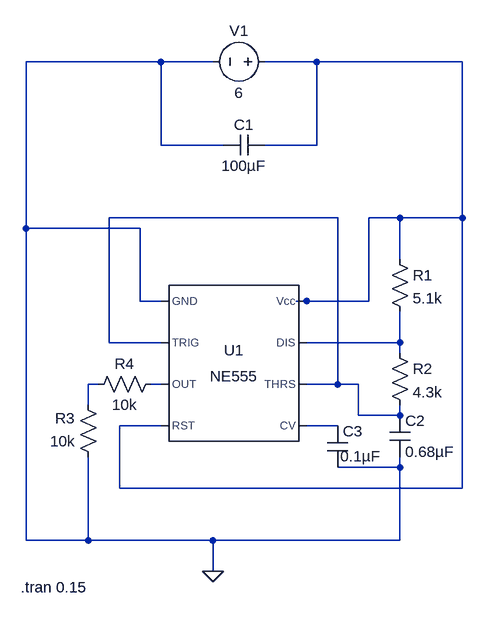
[diagram p0: schematic NE555 multivibrator.asc]
NE555 multivibrator.asc, the LTspice schematic file:
Version 4
SHEET 1 880 680
WIRE 128 -224 -80 -224
WIRE 208 -224 128 -224
WIRE 368 -224 288 -224
WIRE 592 -224 368 -224
WIRE 128 -96 128 -224
WIRE 224 -96 128 -96
WIRE 368 -96 368 -224
WIRE 368 -96 288 -96
WIRE 400 16 48 16
WIRE 496 16 448 16
WIRE 592 16 592 -224
WIRE 592 16 496 16
WIRE -80 32 -80 -224
WIRE 96 32 -80 32
WIRE 496 80 496 16
WIRE 96 144 96 32
WIRE 128 144 96 144
WIRE 352 144 336 144
WIRE 448 144 448 16
WIRE 448 144 352 144
WIRE 48 208 48 16
WIRE 128 208 48 208
WIRE 496 208 496 160
WIRE 496 208 352 208
WIRE 496 224 496 208
WIRE 32 272 16 272
WIRE 128 272 112 272
WIRE 400 272 400 16
WIRE 400 272 352 272
WIRE 432 272 400 272
WIRE 16 304 16 272
WIRE 432 320 432 272
WIRE 496 320 496 304
WIRE 496 320 432 320
WIRE 128 336 64 336
WIRE 400 336 352 336
WIRE 496 400 496 384
WIRE 496 400 400 400
WIRE 64 432 64 336
WIRE 592 432 592 16
WIRE 592 432 64 432
WIRE -80 512 -80 32
WIRE 16 512 16 384
WIRE 16 512 -80 512
WIRE 208 512 16 512
WIRE 496 512 496 400
WIRE 496 512 208 512
WIRE 208 560 208 512
FLAG 208 560 0
SYMBOL Misc\\NE555 240 240 R0
SYMATTR InstName U1
SYMBOL cap 288 -112 R90
WINDOW 0 0 32 VBottom 2
WINDOW 3 32 32 VTop 2
SYMATTR InstName C1
SYMATTR Value 100µF
SYMATTR SpiceLine V=25
SYMBOL cap 480 320 R0
SYMATTR InstName C2
SYMATTR Value 0.68µF
SYMATTR SpiceLine V=25
SYMBOL res 32 400 R180
WINDOW 0 36 76 Left 2
WINDOW 3 36 40 Left 2
SYMATTR InstName R3
SYMATTR Value 10k
SYMBOL res 480 208 R0
SYMATTR InstName R2
SYMATTR Value 4.3k
SYMBOL voltage 304 -224 R90
WINDOW 0 -32 56 VBottom 2
WINDOW 3 32 56 VTop 2
WINDOW 123 0 0 Left 0
WINDOW 39 0 0 Left 0
SYMATTR InstName V1
SYMATTR Value 6
SYMBOL cap 384 336 R0
WINDOW 3 20 47 Left 2
SYMATTR Value 0.1µF
SYMATTR InstName C3
SYMBOL res 480 64 R0
SYMATTR InstName R1
SYMATTR Value 5.1k
SYMBOL res 128 256 R90
WINDOW 0 0 56 VBottom 2
WINDOW 3 32 56 VTop 2
SYMATTR InstName R4
SYMATTR Value 10k
TEXT -88 584 Left 2 !.tran 0.15

The netlist it stands for:
* NE555 multivibrator.asc
XU1 0 N002 N005 N001 N006 N002 N003 N001 NE555  ; pins GND TRIG OUT RST CV THRS DIS Vcc
C1 N001 0 100µF V=25
C2 N002 0 0.68µF V=25
R3 0 N004 10k
R2 N003 N002 4.3k
V1 N001 0 6
C3 N006 0 0.1µF
R1 N001 N003 5.1k
R4 N005 N004 10k
.tran 0.15
.lib NE555.sub
.backanno
.end